# EAGLE design evalboard_v2_9 (EAGLE 9.6.2)
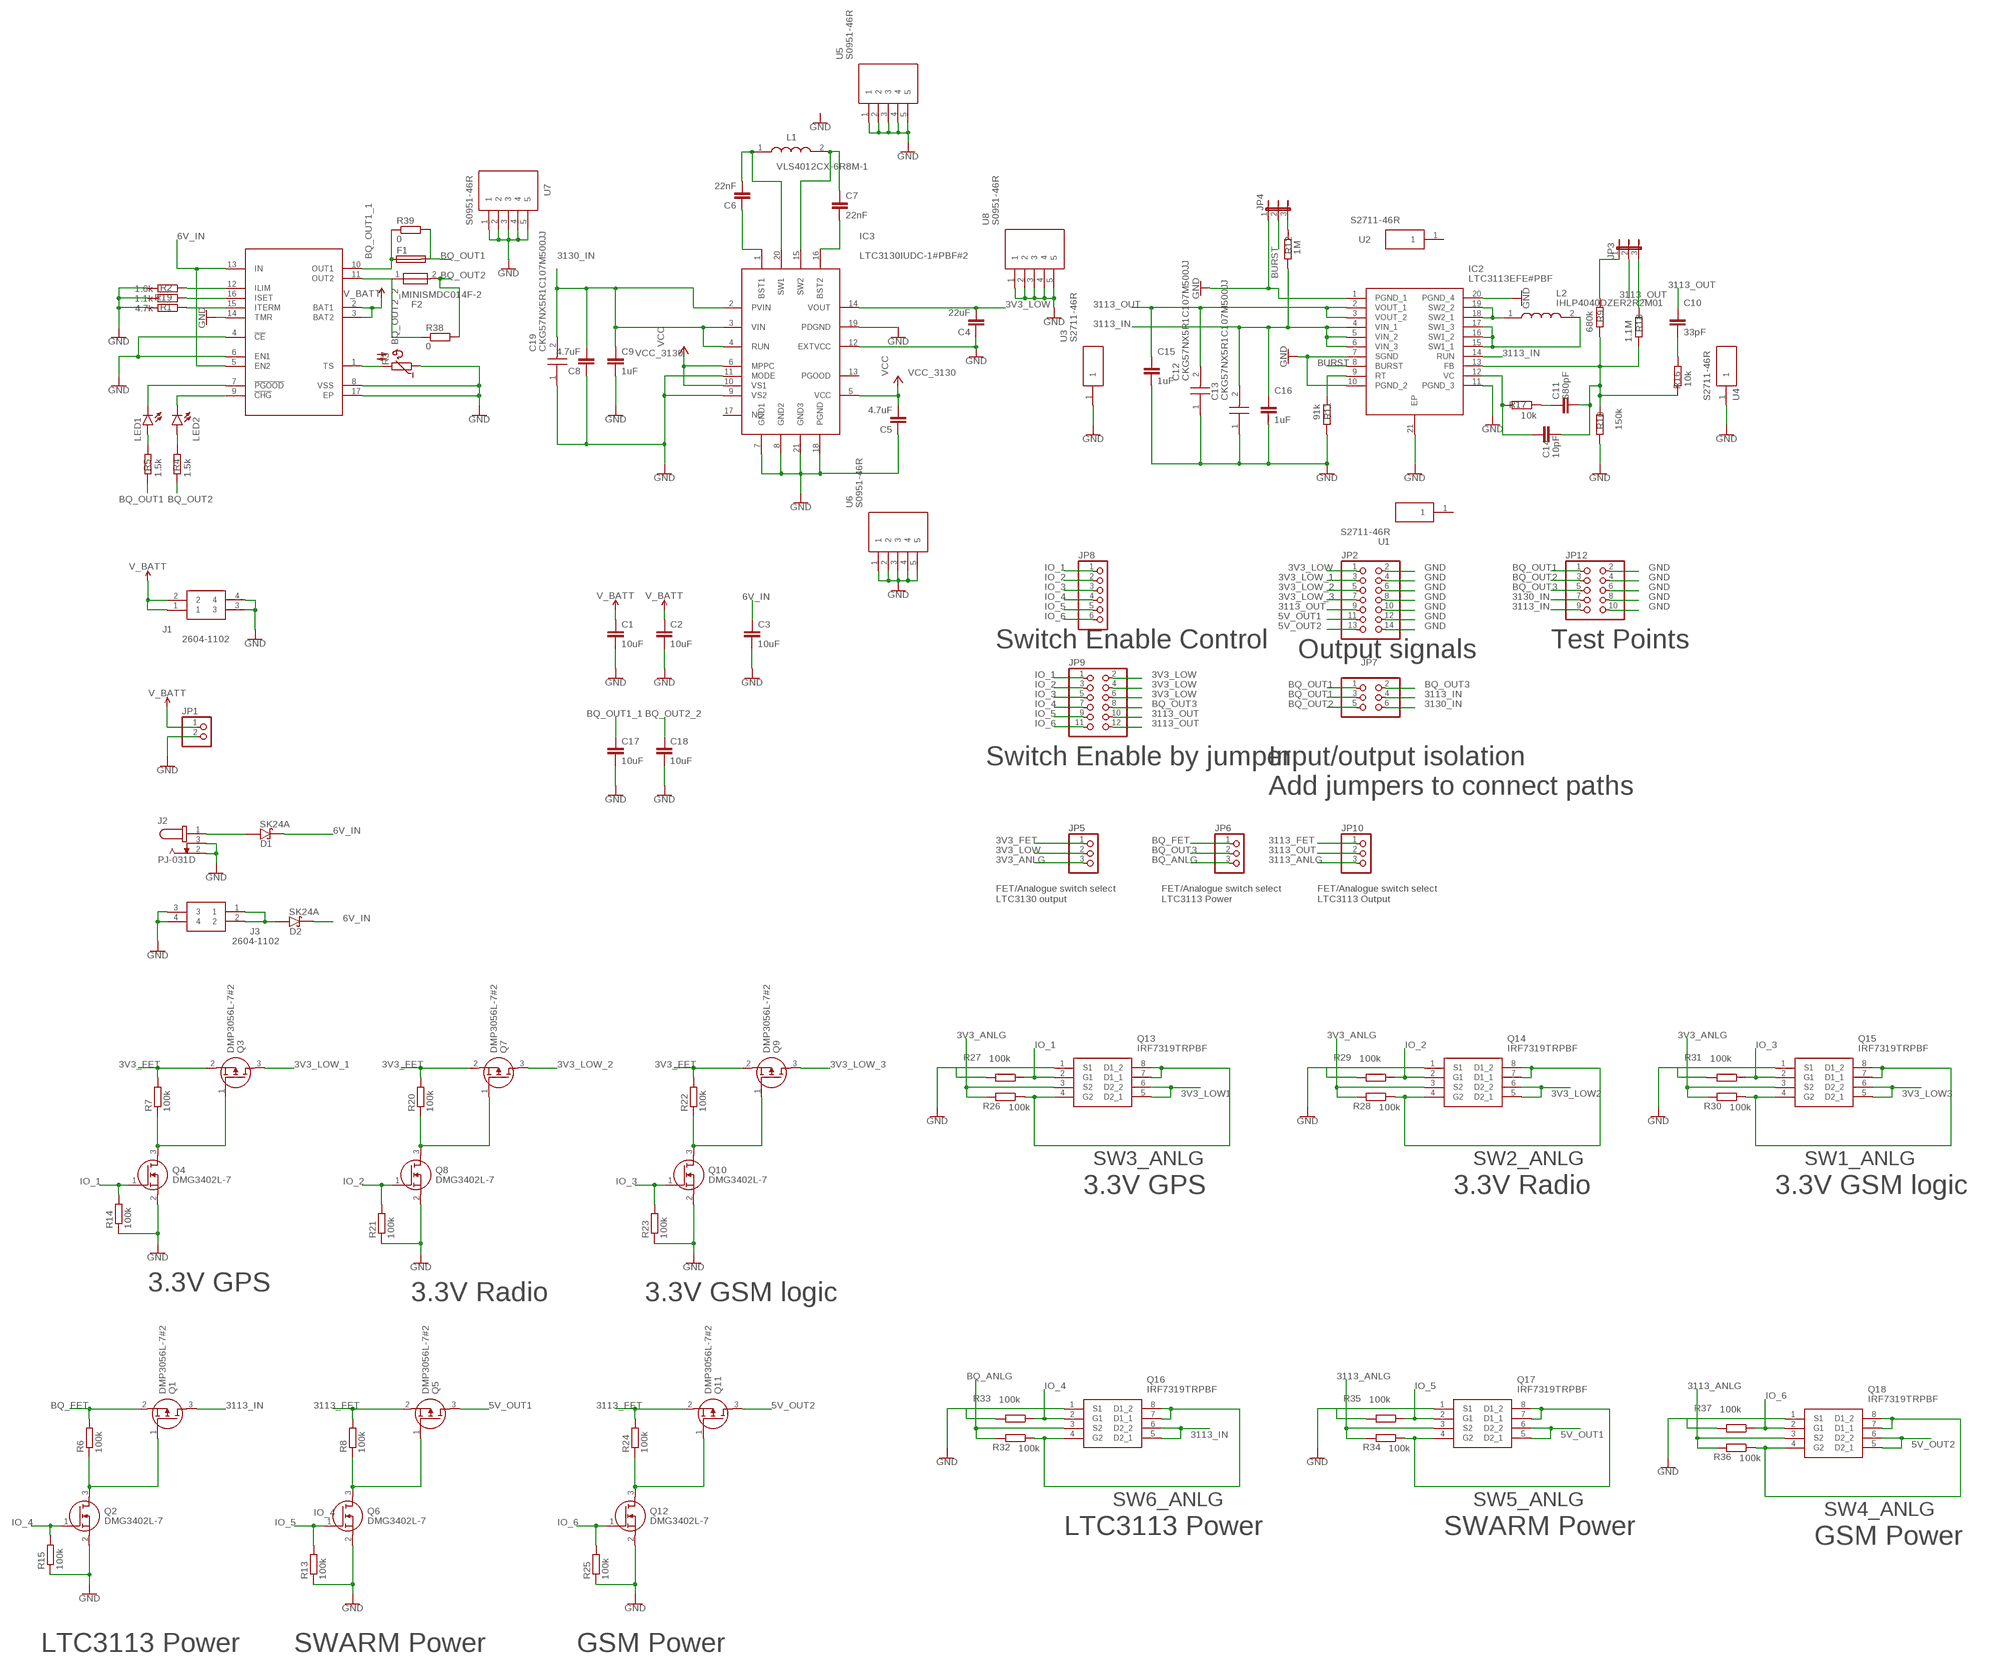
[diagram p0: schematic, sheet 1]

## Parts
C1  10uF  C-EUC1210  [C1210]
C2  10uF  C-EUC1210  [C1210]
C3  10uF  C-EUC1210  [C1210]
C4  22uF  C-EUC1210  [C1210]
C5  4.7uF  C-EUC1210  [C1210]
C6  22nF  C-EUC0603  [C0603]
C7  22nF  C-EUC0603  [C0603]
C8  4.7uF  C-EUC1210  [C1210]
C9  1uF  C-EUC0603  [C0603]
C10  33pF  C-EUC0603  [C0603]
C11  680pF  C-EUC0603  [C0603]
C12  CKG57NX5R1C107M500JJ  [CAPC6050X550N]
C13  CKG57NX5R1C107M500JJ  [CAPC6050X550N]
C14  10pF  C-EUC0603  [C0603]
C15  1uF  C-EUC0603  [C0603]
C16  1uF  C-EUC0603  [C0603]
C17  10uF  C-EUC1210  [C1210]
C18  10uF  C-EUC1210  [C1210]
C19  CKG57NX5R1C107M500JJ  [CAPC6050X550N]
D1  SK24A  [DIOM4325X250N]
D2  SK24A  [DIOM4325X250N]
F1  MF-USHT150KX-2SMD  [1210]
F2  MINISMDC014F-2  [FUSSC455X324X89-2N]
IC1  BQ24074  [QFN50P300X300X100-17N]
IC2  LTC3113EFE#PBF  [SOP65P640X120-21N]
IC3  LTC3130IUDC-1#PBF#2  [QFN50P300X400X80-21N]
J1  2604-1102  [26041102]
J2  PJ-031D  [CUI_PJ-031D]
J3  2604-1102  [26041102]
JP1  PINHD-1X2  [1X02]
JP2  PINHD-2X7  [2X07]
JP3  JP2E  [JP2]
JP4  JP2E  [JP2]
JP5  PINHD-1X3  [1X03]
JP6  PINHD-1X3  [1X03]
JP7  PINHD-2X3  [2X03]
JP8  PINHD-1X6  [1X06]
JP9  PINHD-2X6  [2X06]
JP10  PINHD-1X3  [1X03]
JP12  PINHD-2X5  [2X05]
L1  VLS4012CX-6R8M-1  [VLS4012]
L2  IHLP4040DZER2R2M01  [INDPM108102X400N]
LED1  LEDCHIP-LED0603  [CHIP-LED0603]
LED2  LEDCHIP-LED0603  [CHIP-LED0603]
Q1  DMP3056L-7#2  [SOT96P240X100-3N]
Q2  DMG3402L-7  [SOT96P240X110-3N]
Q3  DMP3056L-7#2  [SOT96P240X100-3N]
Q4  DMG3402L-7  [SOT96P240X110-3N]
Q5  DMP3056L-7#2  [SOT96P240X100-3N]
Q6  DMG3402L-7  [SOT96P240X110-3N]
Q7  DMP3056L-7#2  [SOT96P240X100-3N]
Q8  DMG3402L-7  [SOT96P240X110-3N]
Q9  DMP3056L-7#2  [SOT96P240X100-3N]
Q10  DMG3402L-7  [SOT96P240X110-3N]
Q11  DMP3056L-7#2  [SOT96P240X100-3N]
Q12  DMG3402L-7  [SOT96P240X110-3N]
Q13  IRF7319TRPBF  [SOIC127P600X175-8N]
Q14  IRF7319TRPBF  [SOIC127P600X175-8N]
Q15  IRF7319TRPBF  [SOIC127P600X175-8N]
Q16  IRF7319TRPBF  [SOIC127P600X175-8N]
Q17  IRF7319TRPBF  [SOIC127P600X175-8N]
Q18  IRF7319TRPBF  [SOIC127P600X175-8N]
R1  4.7k  R-EU_R0603  [R0603]
R2  1.6k  R-EU_R0603  [R0603]
R3  10k  NTC640  [P640]
R4  1.5k  R-EU_R0603  [R0603]
R5  1.5k  R-EU_R0603  [R0603]
R6  100k  R-EU_R0603  [R0603]
R7  100k  R-EU_R0603  [R0603]
R8  100k  R-EU_R0603  [R0603]
R9  680k  R-EU_R0603  [R0603]
R10  150k  R-EU_R0603  [R0603]
R11  91k  R-EU_R0603  [R0603]
R12  1M  R-EU_R0603  [R0603]
R13  100k  R-EU_R0603  [R0603]
R14  100k  R-EU_R0603  [R0603]
R15  100k  R-EU_R0603  [R0603]
R16  10k  R-EU_R0603  [R0603]
R17  10k  R-EU_R0603  [R0603]
R18  1.1M  R-EU_R0603  [R0603]
R19  1.1k  R-EU_R0603  [R0603]
R20  100k  R-EU_R0603  [R0603]
R21  100k  R-EU_R0603  [R0603]
R22  100k  R-EU_R0603  [R0603]
R23  100k  R-EU_R0603  [R0603]
R24  100k  R-EU_R0603  [R0603]
R25  100k  R-EU_R0603  [R0603]
R26  100k  R-EU_R0603  [R0603]
R27  100k  R-EU_R0603  [R0603]
R28  100k  R-EU_R0603  [R0603]
R29  100k  R-EU_R0603  [R0603]
R30  100k  R-EU_R0603  [R0603]
R31  100k  R-EU_R0603  [R0603]
R32  100k  R-EU_R0603  [R0603]
R33  100k  R-EU_R0603  [R0603]
R34  100k  R-EU_R0603  [R0603]
R35  100k  R-EU_R0603  [R0603]
R36  100k  R-EU_R0603  [R0603]
R37  100k  R-EU_R0603  [R0603]
R38  0  R-EU_R0603  [R0603]
R39  0  R-EU_R0603  [R0603]
U1  S2711-46R  [S271146R]
U2  S2711-46R  [S271146R]
U3  S2711-46R  [S271146R]
U4  S2711-46R  [S271146R]
U5  S0951-46R  [S095146R]
U6  S0951-46R  [S095146R]
U7  S0951-46R  [S095146R]
U8  S0951-46R  [S095146R]

## Nets
3V3_ANLG: JP5.3 Q13.3(S2) Q14.3(S2) Q15.3(S2) R26.2 R28.2 R30.2
3V3_FET: JP5.1 Q3.2(S) Q7.2(S) Q9.2(S) R7.2 R20.2 R22.2
3V3_LOW: C4.2 IC3.14(VOUT) JP2.1 JP5.2 JP9.2 JP9.4 JP9.6
3V3_LOW1: Q13.5(D2_1) Q13.6(D2_2)
3V3_LOW2: Q14.5(D2_1) Q14.6(D2_2)
3V3_LOW3: Q15.5(D2_1) Q15.6(D2_2)
3V3_LOW_1: JP2.3 Q3.3(D)
3V3_LOW_2: JP2.5 Q7.3(D)
3V3_LOW_3: JP2.7 Q9.3(D)
5V_OUT1: JP2.11 Q5.3(D) Q17.5(D2_1) Q17.6(D2_2)
5V_OUT2: JP2.13 Q11.3(D) Q18.5(D2_1) Q18.6(D2_2)
6V_IN: C3.1 D1.C(K) D2.C(K) IC1.5(EN2) IC1.13(IN)
3113_ANLG: JP10.3 Q17.3(S2) Q18.3(S2) R34.2 R36.2
3113_FET: JP10.1 Q5.2(S) Q11.2(S) R8.2 R24.2
3113_IN: C13.2 C16.1 IC2.4(VIN_1) IC2.5(VIN_2) IC2.6(VIN_3) IC2.14(RUN) JP7.4 JP12.9 Q1.3(D) Q16.5(D2_1) Q16.6(D2_2) R12.1
3113_OUT: C10.1 C12.2 C15.1 IC2.2(VOUT_1) IC2.3(VOUT_2) JP2.9 JP3.2 JP9.10 JP9.12 JP10.2
3130_IN: C8.2 C9.1 C19.2 IC3.2(PVIN) IC3.3(VIN) IC3.4(RUN) JP7.6 JP12.7
BQ_ANLG: JP6.3 Q16.3(S2) R32.2
BQ_FET: JP6.1 Q1.2(S) R6.2
BQ_OUT1: F1.2 JP7.1 JP7.3 JP12.1 R5.2 R39.2
BQ_OUT1_1: C17.1 F1.1 IC1.10(OUT1) R39.1
BQ_OUT2: F2.2 JP7.5 JP12.3 R4.2 R38.2
BQ_OUT2_2: C18.1 F2.1 IC1.11(OUT2) R38.1
BQ_OUT3: JP6.2 JP7.2 JP9.8 JP12.5
BURST: IC2.8(BURST) JP4.2
GND: C1.2 C2.2 C3.2 C4.1 C5.1 C8.1 C9.2 C12.1 C13.1 C15.2 C16.2 C17.2 C18.2 C19.1 IC1.4(!CE!) IC1.6(EN1) IC1.8(VSS) IC1.14(TMR) IC1.17(EP) IC2.1(PGND_1) IC2.7(SGND) IC2.10(PGND_2) IC2.11(PGND_3) IC2.20(PGND_4) IC2.21(EP) IC3.7(GND1) IC3.8(GND2) IC3.9(VS2) IC3.11(MODE) IC3.12(EXTVCC) IC3.18(PGND) IC3.19(PDGND) IC3.21(GND3) J1.3 J1.4 J2.2 J2.3 J3.3 J3.4 JP1.2 JP2.2 JP2.4 JP2.6 JP2.8 JP2.10 JP2.12 JP2.14 JP4.1 JP12.2 JP12.4 JP12.6 JP12.8 JP12.10 Q2.2(S) Q4.2(S) Q6.2(S) Q8.2(S) Q10.2(S) Q12.2(S) Q13.1(S1) Q14.1(S1) Q15.1(S1) Q16.1(S1) Q17.1(S1) Q18.1(S1) R1.2 R2.2 R3.1 R10.1 R11.1 R13.1 R14.1 R15.1 R19.2 R21.1 R23.1 R25.1 U3.1 U4.1 U5.1 U5.2 U5.3 U5.4 U5.5 U6.1 U6.2 U6.3 U6.4 U6.5 U7.1 U7.2 U7.3 U7.4 U7.5 U8.1 U8.2 U8.3 U8.4 U8.5
IO_1: JP8.1 JP9.1 Q4.1(G) Q13.2(G1) R14.2 R27.1 R27.2 R29.2 R31.2 R33.2 R35.2 R37.2
IO_2: JP8.2 JP9.3 Q8.1(G) Q14.2(G1) R21.2 R29.1
IO_3: JP8.3 JP9.5 Q10.1(G) Q15.2(G1) R23.2 R31.1
IO_4: JP8.4 JP9.7 Q2.1(G) Q16.2(G1) R15.2 R33.1
IO_5: JP8.5 JP9.9 Q6.1(G) Q17.2(G1) R13.2 R35.1
IO_6: JP8.6 JP9.11 Q12.1(G) Q18.2(G1) R25.2 R37.1
N$1: IC1.15(ITERM) R1.1
N$2: IC1.12(ILIM) R2.1
N$3: IC1.9(!CHG!) LED2.C
N$4: IC1.1(TS) R3.2
N$5: IC1.7(!PGOOD!) LED1.C
N$6: LED1.A R5.1
N$7: LED2.A R4.1
N$8: Q3.1(G) Q4.3(D) R7.1
N$9: D1.A J2.1
N$10: Q1.1(G) Q2.3(D) R6.1
N$11: Q5.1(G) Q6.3(D) R8.1
N$12: IC2.18(SW2_1) IC2.19(SW2_2) L2.1
N$13: IC2.15(SW1_1) IC2.16(SW1_2) IC2.17(SW1_3) L2.2
N$14: JP3.3 R18.2
N$15: C6.2 IC3.20(SW1) L1.1
N$16: C6.1 IC3.1(BST1)
N$17: C7.2 IC3.16(BST2)
N$18: IC2.9(RT) R11.2
N$19: C7.1 IC3.15(SW2) L1.2
N$20: JP4.3 R12.2
N$21: C11.1 R17.1
N$22: C10.2 R16.1
N$23: C11.2 C14.2 IC2.13(FB) R9.1 R10.2 R16.2 R18.1
N$24: C14.1 IC2.12(VC) R17.2
N$25: IC1.16(ISET) R19.1
N$26: JP3.1 R9.2
N$27: Q7.1(G) Q8.3(D) R20.1
N$28: Q9.1(G) Q10.3(D) R22.1
N$29: Q11.1(G) Q12.3(D) R24.1
N$30: Q14.4(G2) Q14.7(D1_1) Q14.8(D1_2) R28.1
N$31: Q15.4(G2) Q15.7(D1_1) Q15.8(D1_2) R30.1
N$32: Q16.4(G2) Q16.7(D1_1) Q16.8(D1_2) R32.1
N$33: Q17.4(G2) Q17.7(D1_1) Q17.8(D1_2) R34.1
N$34: Q13.4(G2) Q13.7(D1_1) Q13.8(D1_2) R26.1
N$35: Q18.4(G2) Q18.7(D1_1) Q18.8(D1_2) R36.1
N$37: D2.A J3.1 J3.2
V_BATT: C1.1 C2.1 IC1.2(BAT1) IC1.3(BAT2) J1.1 J1.2 JP1.1
VCC_3130: C5.2 IC3.5(VCC) IC3.6(MPPC) IC3.10(VS1) ; supply symbol labelled VCC
Unconnected: IC3.13(PGOOD) IC3.17(NC) U1.1 U2.1

## Notes on the sheet
- Switch Enable Control | Test Points
- Output signals
- Switch Enable by jumper
- Input/output isolation
  Add jumpers to connect paths
- FET/Analogue switch select
  LTC3130 output
- FET/Analogue switch select
  LTC3113 Power
- FET/Analogue switch select
  LTC3113 Output
- SW3_ANLG | SW2_ANLG | SW1_ANLG
- 3.3V GPS | 3.3V Radio | 3.3V GSM logic
- 3.3V GPS
- 3.3V Radio | 3.3V GSM logic
- SW6_ANLG | SW5_ANLG
- SW4_ANLG
- LTC3113 Power | SWARM Power
- GSM Power
- LTC3113 Power | SWARM Power | GSM Power

## Library data of the parts
C1-C11 C14-C18 = rcl:C-EU: CAPACITOR, European symbol; SPICEPREFIX: C
C12 C13 C19 = SamacSys_Parts:CKG57NX5R1C107M500JJ: Multilayer Ceramic Capacitors MLCC - SMD/SMT CKG 2220 16V 100uF 20% T:5mm AEC-Q200 Source: Datasheet <https://product.tdk.com/system/files/dam/doc/product/capacitor/ceramic/mlcc/catalog/mlcc_automotive_megacap_en.pdf>; DESCRIPTION: Multilayer Ceramic Capacitors MLCC - SMD/SMT CKG 2220 16V 100uF 20% T:5mm AEC-Q200; HEIGHT: 5.5mm; MANUFACTURER_NAME: TDK; MANUFACTURER_PART_NUMBER: CKG57NX5R1C107M500JJ; MOUSER_PART_NUMBER: 810-CKG57NX5R1C107MJ; MOUSER_PRICE-STOCK: https://www.mouser.co.uk/ProductDetail/TDK/CKG57NX5R1C107M500JJ?qs=xLDY6iXSiQbsKuTXjNfGvw%3D%3D
D1 D2 = SK24A:SK24A; DESCRIPTION: Diode Schottky 40 V - Surface Mount SMA (DO-214AC); DIGI-KEY_PART_NUMBER: 1655-SK24ATR-ND; MF: SMC Diode; MP: SK24A; PACKAGE: SMA Taiwan Semiconductor; PURCHASE-URL: https://pricing.snapeda.com/search/part/SK24A/?ref=eda
F1 = my_library:MF-USHT150KX-2
F2 = MINISMDC014F-2:MINISMDC014F-2: PTC RESET FUSE 60V 140MA 1812 Check availability <https://pricing.snapeda.com/parts/MINISMDC014F-2/Littelfuse%20Inc./view-part?ref=eda>; AVAILABILITY: In Stock; DESCRIPTION: Polymeric PTC Resettable Fuse 60V 140 mA Ih Surface Mount 1812 (4532 Metric), Concave; MF: Littelfuse Inc.; MP: MINISMDC014F-2; PACKAGE: None; PRICE: None; PURCHASE-URL: https://pricing.snapeda.com/search/part/MINISMDC014F-2/?ref=eda
IC1 = SamacSys_Parts:BQ24074
IC2 = SamacSys_Parts:LTC3113EFE#PBF: Buck-Boost Switching Regulator IC Positive Adjustable 1.8V 1 Output 3A 20-TSSOP (0.173", 4.40mm Width) Exposed Pad Source: Datasheet <http://www.linear.com/docs/30065>; DESCRIPTION: Buck-Boost Switching Regulator IC Positive Adjustable 1.8V 1 Output 3A 20-TSSOP (0.173", 4.40mm Width) Exposed Pad; HEIGHT: 1.2mm; MANUFACTURER_NAME: Analog Devices; MANUFACTURER_PART_NUMBER: LTC3113EFE#PBF; MOUSER_PART_NUMBER: 584-LTC3113EFE#PBF; MOUSER_PRICE-STOCK: https://www.mouser.co.uk/ProductDetail/Analog-Devices-Linear-Technology/LTC3113EFEPBF?qs=hVkxg5c3xu9hNe5Vps7nKA%3D%3D
IC3 = SamacSys_Parts:LTC3130IUDC-1#PBF#2: LINEAR TECHNOLOGY - LTC3130IUDC-1#PBF - DC/DC Switching Buck-Boost Regulator, Adjustable, 2.4V-25V in, 1.8V-12V out, 600 mA, QFN-20 Source: Datasheet <https://ms.componentsearchengine.com/Datasheets/2/LTC3130IUDC-1#PBF.pdf>; DESCRIPTION: LINEAR TECHNOLOGY - LTC3130IUDC-1#PBF - DC/DC Switching Buck-Boost Regulator, Adjustable, 2.4V-25V in, 1.8V-12V out, 600 mA, QFN-20; HEIGHT: 0.8mm; MANUFACTURER_NAME: Analog Devices; MANUFACTURER_PART_NUMBER: LTC3130IUDC-1#PBF
J1 J3 = SamacSys_Parts:2604-1102: WAGO - 2604-1102 - TB, WIRE TO BOARD, 2POS, 24-12AWG Source: Datasheet <https://www.wago.com/de/leiterplattenanschluss/leiterplattenklemme/p/2604-1102>; ARROW_PART_NUMBER: 2604-1102; ARROW_PRICE-STOCK: https://www.arrow.com/en/products/2604-1102/wago-kontakttechnik-gmbh?region=nac; DESCRIPTION: WAGO - 2604-1102 - TB, WIRE TO BOARD, 2POS, 24-12AWG; HEIGHT: 16.7mm; MANUFACTURER_NAME: Wago; MANUFACTURER_PART_NUMBER: 2604-1102
J2 = PJ-031D:PJ-031D: 1.3 mm Center Pin, 2.0 A, Right Angle, Through Hole, Dc Power Jack Connector Check availability <https://pricing.snapeda.com/parts/PJ-031D/CUI%20Devices/view-part?ref=eda>; AVAILABILITY: In Stock; CUI_PURCHASE_URL: https://www.cuidevices.com/product/interconnect/connectors/dc-power-connectors/jacks/pj-031d?utm_source=snapeda.com&utm_medium=referral&utm_campaign=snapedaBOM; DESCRIPTION: 1.3 x 4.2 mm, 2.0 A, Horizontal, Through Hole, Dc Power Jack Connector; MF: CUI Devices; MP: PJ-031D; PACKAGE: None; PRICE: None; PURCHASE-URL: https://pricing.snapeda.com/search/part/PJ-031D/?ref=eda
JP1 = pinhead:PINHD-1X2: PIN HEADER
JP2 = pinhead:PINHD-2X7: PIN HEADER
JP3 JP4 = jumper:JP2E: JUMPER
JP5 JP6 JP10 = pinhead:PINHD-1X3: PIN HEADER
JP7 = pinhead:PINHD-2X3: PIN HEADER
JP8 = pinhead:PINHD-1X6: PIN HEADER
JP9 = pinhead:PINHD-2X6: PIN HEADER
JP12 = pinhead:PINHD-2X5: PIN HEADER
L1 = SamacSys_Parts:VLS4012CX-6R8M-1: SMD / SMT Inductors (Coils), L=6.8?H, L x W x T : Source: Datasheet <https://product.tdk.com/system/files/dam/doc/product/inductor/inductor/smd/catalog/inductor_commercial_power_vls4012cx-1_en.pdf>; DESCRIPTION: SMD / SMT Inductors (Coils), L=6.8?H, L x W x T :; HEIGHT: mm; MANUFACTURER_NAME: TDK; MANUFACTURER_PART_NUMBER: VLS4012CX-6R8M-1
L2 = SamacSys_Parts:IHLP4040DZER2R2M01: Vishay IHLP4040DZ-01 Series Shielded Wire-wound SMD Inductor 2.2 uH +/-20% 25.6A Idc Source: Datasheet <https://www.vishay.com/docs/34193/ihlp-4040dz-01.pdf>; ARROW_PART_NUMBER: IHLP4040DZER2R2M01; ARROW_PRICE-STOCK: https://www.arrow.com/en/products/ihlp4040dzer2r2m01/vishay?region=europe; DESCRIPTION: Vishay IHLP4040DZ-01 Series Shielded Wire-wound SMD Inductor 2.2 uH +/-20% 25.6A Idc; HEIGHT: 4mm; MANUFACTURER_NAME: Vishay; MANUFACTURER_PART_NUMBER: IHLP4040DZER2R2M01; MOUSER_PART_NUMBER: 70-IHLP4040DZER2R2M0; MOUSER_PRICE-STOCK: https://www.mouser.co.uk/ProductDetail/Vishay-Dale/IHLP4040DZER2R2M01?qs=25W9pqL97j%252B8m%252BOw36nwKg%3D%3D
LED1 LED2 = led:LED: LED OSRAM: - CHIPLED LG R971, LG N971, LY N971, LG Q971, LY Q971, LO R971, LY R971 LH N974, LH R974 LS Q976, LO Q976, LY Q976 LO Q996 - Hyper CHIPLED LW Q18S LB Q993, LB Q99A, LB R99A - SideLED LS A670, LO A670, LY A670, LG A670, LP A670 LB A673, LV A673, LT A673, LW A673 LH A674 LY A675 LS A676, LA A676, LO A676, LY A676, LW A676 LS A679, LY A679, LG A679 - Hyper Micro SIDELED® LS Y876, LA Y876, LO Y876, LY Y876 LT Y87S - SmartLED LW L88C, LW L88S LB L89C, LB L89S, LG L890 LS L89K, LO L89K, LY L89K LS L896, LA L896, LO L896, LY L896 - TOPLED LS T670, LO T670, LY T670, LG T670, LP T670 LSG T670, LSP T670, LSY T670, LOP T670, LYG T670 LG T671, LOG T671, LSG T671 LB T673, LV T673, LT T673, LW T673 LH T674 LS T676, LA T676, LO T676, LY T676, LB T676, LH T676, LSB T676, LW T676 LB T67C, LV T67C, LT T67C, LS T67K, LO T67K, LY T67K, LW E67C LS E67B, LA E67B, LO E67B, LY E67B, LB E67C, LV E67C, LT E67C LW T67C LS T679, LY T679, LG T679 LS T770, LO T770, LY T770, LG T770, LP T770 LB T773, LV T773, LT T773, LW T773 LH T774 LS E675, LA E675, LY E675, LS T675 LS T776, LA T776, LO T776, LY T776, LB T776 LHGB T686 LT T68C, LB T68C - Hyper Mini TOPLED® LB M676 - Mini TOPLED Santana® LG M470 LS M47K, LO M47K, LY M47K Source: http://www.osram.convergy.de LUXEON: - LUMILED® LXK2-PW12-R00, LXK2-PW12-S00, LXK2-PW14-U00, LXK2-PW14-V00 LXK2-PM12-R00, LXK2-PM12-S00, LXK2-PM14-U00 LXK2-PE12-Q00, LXK2-PE12-R00, LXK2-PE12-S00, LXK2-PE14-T00, LXK2-PE14-U00 LXK2-PB12-K00, LXK2-PB12-L00, LXK2-PB12-M00, LXK2-PB14-N00, LXK2-PB14-P00, LXK2-PB14-Q00 LXK2-PR12-L00, LXK2-PR12-M00, LXK2-PR14-Q00, LXK2-PR14-R00 LXK2-PD12-Q00, LXK2-PD12-R00, LXK2-PD12-S00 LXK2-PH12-R00, LXK2-PH12-S00 LXK2-PL12-P00, LXK2-PL12-Q00, LXK2-PL12-R00 Source: www.luxeon.com KINGBRIGHT: KA-3528ASYC Source: www.kingbright.com
Q1 Q3 Q5 Q7 Q9 Q11 = SamacSys_Parts:DMP3056L-7#2: MOSFET 30V P-Ch Enh Mode 50mOhm -10Vgs -4.3A Source: Datasheet <https://www.diodes.com/assets/Datasheets/DMP3056L.pdf>; ARROW_PART_NUMBER: DMP3056L-7; ARROW_PRICE-STOCK: https://www.arrow.com/en/products/dmp3056l-7/diodes-incorporated?region=nac; DESCRIPTION: MOSFET 30V P-Ch Enh Mode 50mOhm -10Vgs -4.3A; HEIGHT: 1mm; MANUFACTURER_NAME: Diodes Inc.; MANUFACTURER_PART_NUMBER: DMP3056L-7; MOUSER_PART_NUMBER: 621-DMP3056L-7; MOUSER_PRICE-STOCK: https://www.mouser.co.uk/ProductDetail/Diodes-Incorporated/DMP3056L-7?qs=OVC8WVYZliQTX9kMWW%252B96Q%3D%3D
Q2 Q4 Q6 Q8 Q10 Q12 = SamacSys_Parts:DMG3402L-7: Diodes Inc DMG3402L-7 N-channel MOSFET Transistor, 4 A, 30 V, 3-Pin SOT-23 Source: Datasheet <https://www.diodes.com/assets/Datasheets/DMG3402L.pdf>; ARROW_PART_NUMBER: DMG3402L-7; ARROW_PRICE-STOCK: https://www.arrow.com/en/products/dmg3402l-7/diodes-incorporated?region=nac; DESCRIPTION: Diodes Inc DMG3402L-7 N-channel MOSFET Transistor, 4 A, 30 V, 3-Pin SOT-23; HEIGHT: 1.1mm; MANUFACTURER_NAME: Diodes Inc.; MANUFACTURER_PART_NUMBER: DMG3402L-7; MOUSER_PART_NUMBER: 621-DMG3402L-7; MOUSER_PRICE-STOCK: https://www.mouser.co.uk/ProductDetail/Diodes-Incorporated/DMG3402L-7?qs=M%2FOdCRO8QQ3OmR%252BxqWZuSw%3D%3D
Q13-Q18 = SamacSys_Parts:IRF7319TRPBF: IRF7319TRPBF Dual N/P-Channel MOSFET, 4.9 A, 6.5 A, 30 V HEXFET, 8-Pin SOIC Infineon Source: Datasheet <https://www.infineon.com/dgdl/irf7319pbf.pdf?fileId=5546d462533600a4015355f5c82f1b41>; ARROW_PART_NUMBER: IRF7319TRPBF; ARROW_PRICE-STOCK: https://www.arrow.com/en/products/irf7319trpbf/infineon-technologies-ag?region=nac; DESCRIPTION: IRF7319TRPBF Dual N/P-Channel MOSFET, 4.9 A, 6.5 A, 30 V HEXFET, 8-Pin SOIC Infineon; HEIGHT: 1.75mm; MANUFACTURER_NAME: Infineon; MANUFACTURER_PART_NUMBER: IRF7319TRPBF; MOUSER_PART_NUMBER: 942-IRF7319TRPBF; MOUSER_PRICE-STOCK: https://www.mouser.co.uk/ProductDetail/Infineon-IR/IRF7319TRPBF?qs=9%252BKlkBgLFf3yLUxG6ZIMRA%3D%3D
R1 R2 R4-R39 = rcl:R-EU_: RESISTOR, European symbol; SPICEPREFIX: R
R3 = ptc-ntc:NTC640: PHILIPS NTC; OC_FARNELL: unknown; OC_NEWARK: unknown
U1-U4 = SamacSys_Parts:S2711-46R: EMI Gaskets, Sheets, Absorbers & Shielding EMC Shield Can Clip .17-.3MM Thick Cans Source: Datasheet <https://cdn.harwin.com/pdfs/S2711-46R.pdf>; DESCRIPTION: EMI Gaskets, Sheets, Absorbers & Shielding EMC Shield Can Clip .17-.3MM Thick Cans; HEIGHT: 3.75mm; MANUFACTURER_NAME: Harwin; MANUFACTURER_PART_NUMBER: S2711-46R
U5-U8 = SamacSys_Parts:S0951-46R: EMI Gaskets, Sheets, Absorbers & Shielding EMC Shield Can Clip 0.20MM Thick Cans Source: Datasheet <https://componentsearchengine.com/Datasheets/2/S0951-46R.pdf>; DESCRIPTION: EMI Gaskets, Sheets, Absorbers & Shielding EMC Shield Can Clip 0.20MM Thick Cans; HEIGHT: 1.28mm; MANUFACTURER_NAME: Harwin; MANUFACTURER_PART_NUMBER: S0951-46R; MOUSER_PART_NUMBER: 855-S0951-46R; MOUSER_PRICE-STOCK: https://www.mouser.co.uk/ProductDetail/Harwin/S0951-46R?qs=je9i9FKnZoxYFq7KaU8dxA%3D%3D

## Board
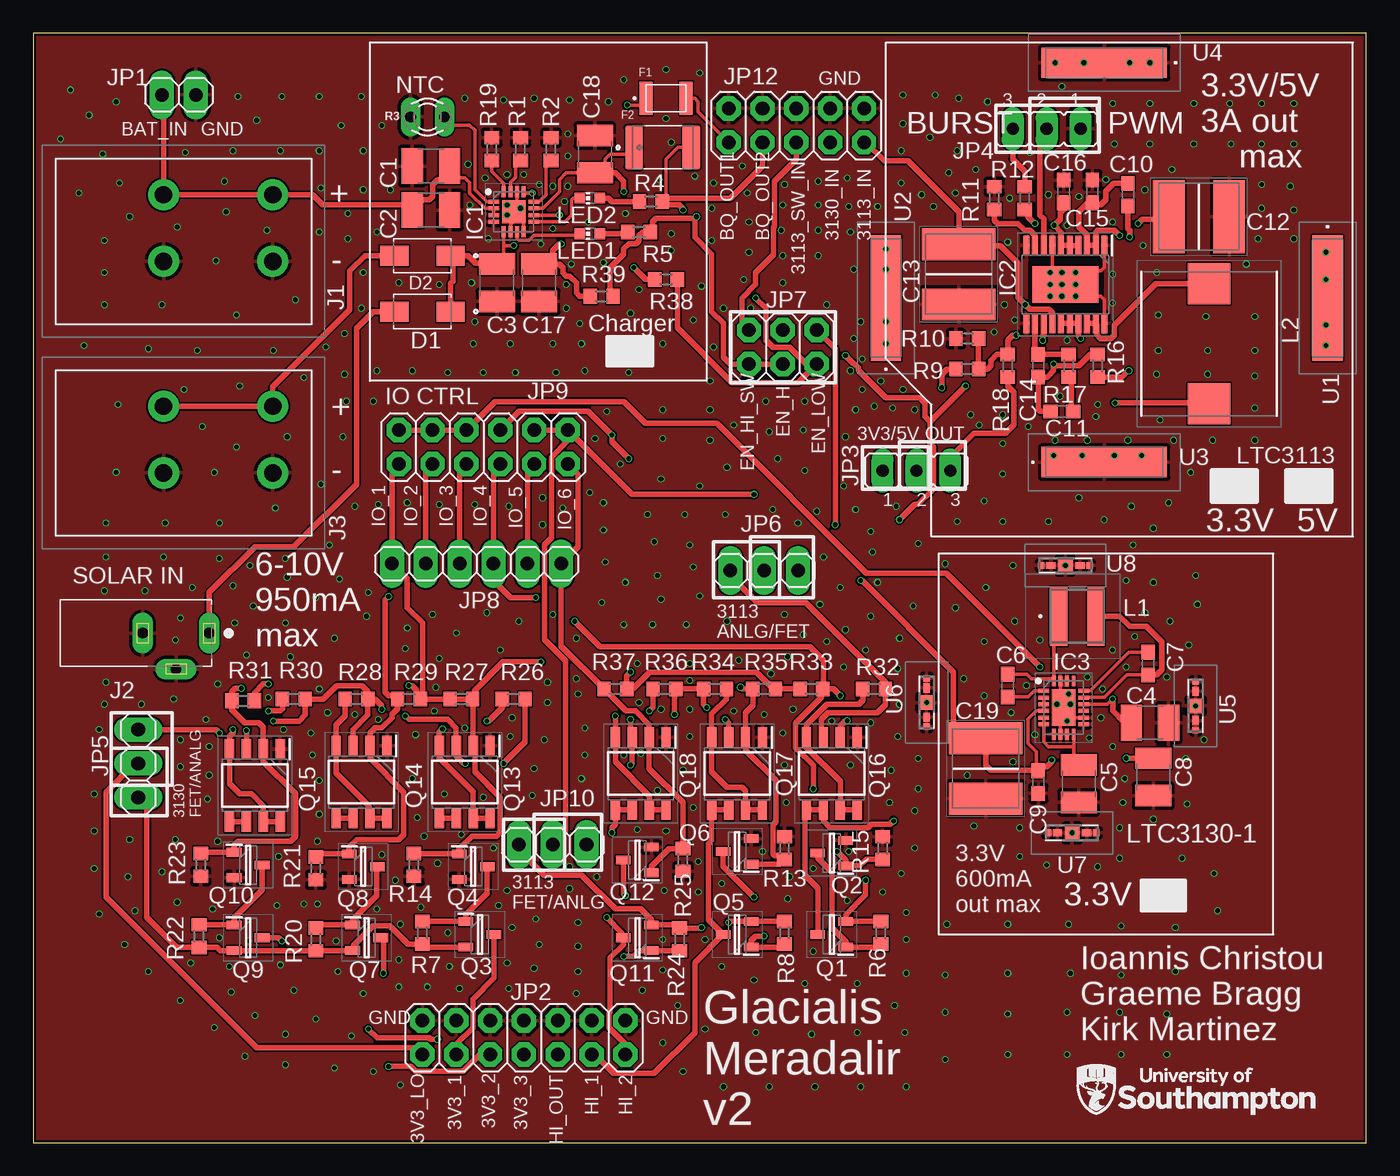
[diagram p1: board, top side]
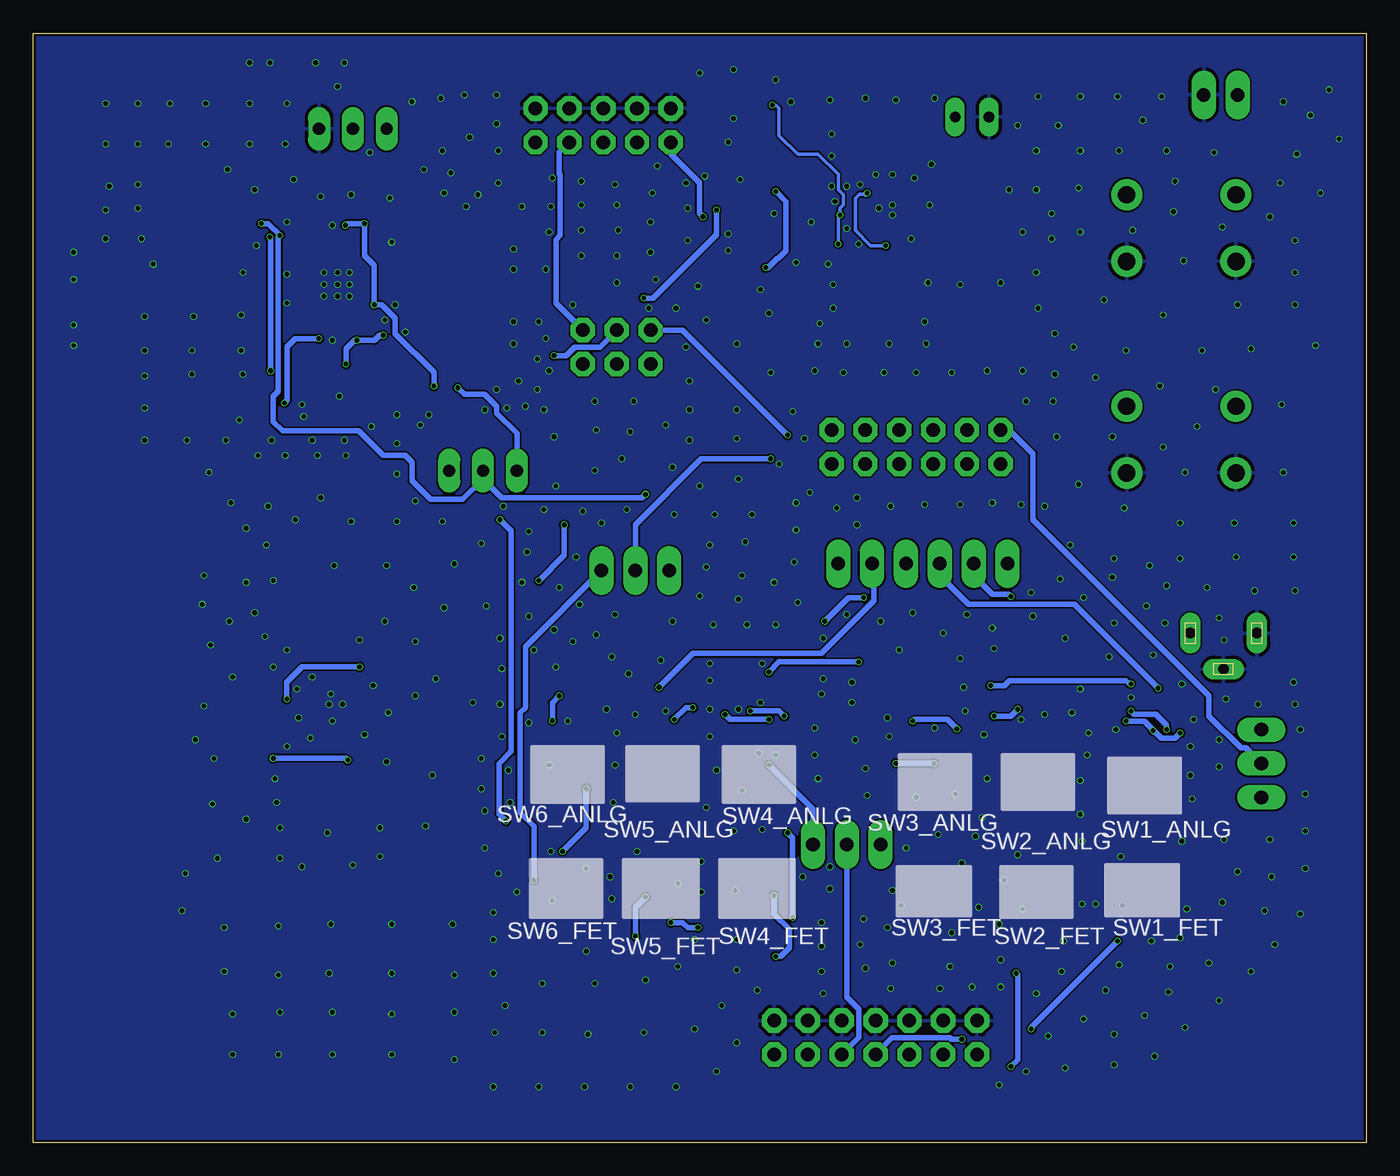
[diagram p2: board, bottom side, seen from below]

Size 100.06 x 83.24 mm. Coordinates in mm from the lower left corner, seen from the top.
Outline: 0,0 100.06,0 100.06,83.24 0,83.24 0,0
Copper layers (1*16): Top 0.035mm / dielectric 1.6mm / Bottom 0.035mm
Design rules "jlcpcb-2layers": minimum track width 5mil, minimum drill 0.3mm, track to track 5mil, track to pad 5mil, pad to pad 5mil, via to via 5mil, smd to smd 5mil, copper to edge 0.2mm, drill to drill 6mil, minimum pad ring 10mil, minimum via ring 3mil, stop-mask expansion 4mil, vias tented up to drill 0mil, thermal gap 10mil
tRestrict: area 35.1,68.8 to 37.1,70.9; area 76.3,31.1 to 78.4,34; area 74.8,62.9 to 80.3,66; area 74.8,62 to 80.1,62.9

### Footprints (pad centres in the part's own frame; a part is rotated, then mirrored left to right if it is on the bottom)
C1210 = smd 1.6 x 2.7: 1 -1.4,0; 2 1.4,0
C0603 = smd 1.1 x 1: 1 -0.85,0; 2 0.85,0
CAPC6050X550N = smd 2.39 x 5.51: 1 -2.26,0; 2 2.26,0
DIOM4325X250N = smd 2.12 x 1.5: A 2.115,0; C -2.115,0
1210 = smd 1 x 2.5: 1 -1.5,0; 2 1.5,0
FUSSC455X324X89-2N = smd 1.34 x 3.29: 1 -2.15,0; 2 2.15,0
QFN50P300X300X100-17N = smd 0.8 x 0.3: 1 -1.5,0.75; 2 -1.5,0.25; 3 -1.5,-0.25; 4 -1.5,-0.75; 9 1.5,-0.75; 10 1.5,-0.25; 11 1.5,0.25; 12 1.5,0.75 | smd 0.3 x 0.8: 5 -0.75,-1.5; 6 -0.25,-1.5; 7 0.25,-1.5; 8 0.75,-1.5; 13 0.75,1.5; 14 0.25,1.5; 15 -0.25,1.5; 16 -0.75,1.5 | smd 1.75 x 1.75: 17 0,0
SOP65P640X120-21N = smd 1.45 x 0.45: 1 -2.925,2.925; 2 -2.925,2.275; 3 -2.925,1.625; 4 -2.925,0.975; 5 -2.925,0.325; 6 -2.925,-0.325; 7 -2.925,-0.975; 8 -2.925,-1.625; 9 -2.925,-2.275; 10 -2.925,-2.925; 11 2.925,-2.925; 12 2.925,-2.275; 13 2.925,-1.625; 14 2.925,-0.975; 15 2.925,-0.325; 16 2.925,0.325; 17 2.925,0.975; 18 2.925,1.625; 19 2.925,2.275; 20 2.925,2.925 | smd 2.74 x 4.95: 21 0,0
QFN50P300X400X80-21N = smd 0.8 x 0.3: 1 -1.5,1.25; 2 -1.5,0.75; 3 -1.5,0.25; 4 -1.5,-0.25; 5 -1.5,-0.75; 6 -1.5,-1.25; 11 1.5,-1.25; 12 1.5,-0.75; 13 1.5,-0.25; 14 1.5,0.25; 15 1.5,0.75; 16 1.5,1.25 | smd 0.3 x 0.8: 7 -0.75,-2; 8 -0.25,-2; 9 0.25,-2; 10 0.75,-2; 17 0.75,2; 18 0.25,2; 19 -0.25,2; 20 -0.75,2 | smd 1.75 x 2.75: 21 0,0
26041102 = drill 1.3 pad 1.95: 1 0,0; 2 0,8.2; 3 5,0; 4 5,8.2
CUI_PJ-031D = drill 0.8 pad 1.524 long: 1 0,0; 2 5,0; 3 2.5,2.7
1X02 = drill 1.016 long: 1 -1.27,0; 2 1.27,0
2X07 = drill 1.016 octagon: 1 -7.62,-1.27; 2 -7.62,1.27; 3 -5.08,-1.27; 4 -5.08,1.27; 5 -2.54,-1.27; 6 -2.54,1.27; 7 0,-1.27; 8 0,1.27; 9 2.54,-1.27; 10 2.54,1.27; 11 5.08,-1.27; 12 5.08,1.27; 13 7.62,-1.27; 14 7.62,1.27
JP2 = drill 0.914 long: 1 -2.54,0; 2 0,0; 3 2.54,0
1X03 = drill 1.016 long: 1 -2.54,0; 2 0,0; 3 2.54,0
2X03 = drill 1.016 octagon: 1 -2.54,-1.27; 2 -2.54,1.27; 3 0,-1.27; 4 0,1.27; 5 2.54,-1.27; 6 2.54,1.27
1X06 = drill 1.016 long: 1 -6.35,0; 2 -3.81,0; 3 -1.27,0; 4 1.27,0; 5 3.81,0; 6 6.35,0
2X06 = drill 1.016 octagon: 1 -6.35,-1.27; 2 -6.35,1.27; 3 -3.81,-1.27; 4 -3.81,1.27; 5 -1.27,-1.27; 6 -1.27,1.27; 7 1.27,-1.27; 8 1.27,1.27; 9 3.81,-1.27; 10 3.81,1.27; 11 6.35,-1.27; 12 6.35,1.27
2X05 = drill 1.016 octagon: 1 -5.08,-1.27; 2 -5.08,1.27; 3 -2.54,-1.27; 4 -2.54,1.27; 5 0,-1.27; 6 0,1.27; 7 2.54,-1.27; 8 2.54,1.27; 9 5.08,-1.27; 10 5.08,1.27
VLS4012 = smd 1.3 x 4.4: 1 -1.4,0; 2 1.4,0
INDPM108102X400N = smd 3.05 x 3.2: 1 -4.5,0; 2 4.5,0
CHIP-LED0603 = smd 0.8 x 0.8: A 0,-0.75; C 0,0.75
SOT96P240X100-3N = smd 1.1 x 0.65: 1 -1.05,0.96; 2 -1.05,-0.96; 3 1.05,0
SOT96P240X110-3N = smd 1.1 x 0.65: 1 -1.05,0.96; 2 -1.05,-0.96; 3 1.05,0
SOIC127P600X175-8N = smd 1.525 x 0.7: 1 -2.712,1.905; 2 -2.712,0.635; 3 -2.712,-0.635; 4 -2.712,-1.905; 5 2.712,-1.905; 6 2.712,-0.635; 7 2.712,0.635; 8 2.712,1.905
R0603 = smd 1 x 1.1: 1 -0.85,0; 2 0.85,0
P640 = drill 0.813 long: 1 -1.27,0; 2 1.27,0
S271146R = smd 9.4 x 2.28: 1 0,0
S095146R = smd 0.48 x 0.5: 1 -1.81,0; 5 1.81,0 | smd 0.7 x 0.5: 2 -1.1,0; 4 1.1,0 | smd 1.1 x 1.2: 3 0,0

### Placement (x,y rotation side)
C1  29.84,73.28 180 top
C2  29.84,69.98 0 top
C3  34.8,64.52 270 top
C4  83.82,31.5 180 top
C5  78.49,26.92 90 top
C6  73.15,34.29 90 top
C7  83.69,35.94 90 top
C8  84.07,27.43 90 top
C9  75.44,27.05 270 top
C10  82.17,71.12 270 top
C11  77.22,54.86 180 top
C12  87.5,69.47 180 top
C13  69.47,65.15 90 top
C14  75.44,58.29 270 top
C15  79.5,71.37 90 top
C16  77.34,71.37 90 top
C17  37.97,64.52 270 top
C18  42.16,74.17 90 top
C19  71.5,28.07 90 top
D1  29.21,62.36 180 top
D2  29.21,66.55 180 top
F1  47.5,78.36 0 top
F2  47.24,74.68 0 top
IC1  36.07,69.85 0 top
IC2  77.47,64.39 270 top
IC3  77.34,32.64 0 top
J1  9.78,71.12 270 top
J2  13.21,38.23 180 top
J3  9.78,55.24 270 top
JP1  10.92,78.61 0 top
JP2  36.83,7.87 0 top
JP3  66.29,50.42 0 top
JP4  76.07,76.07 180 top
JP5  7.87,28.45 90 top
JP6  54.86,42.93 180 top
JP7  56.26,59.69 0 top
JP8  33.27,43.43 0 top
JP9  33.78,52.2 0 top
JP10  38.99,22.35 0 top
JP12  57.28,76.33 0 top
L1  78.36,39.5 0 top
L2  88.27,59.94 270 top
LED1  41.78,68.2 90 top
LED2  41.78,70.87 90 top
Q1  59.94,15.62 180 top
Q2  59.94,21.72 180 top
Q3  33.53,15.62 0 top
Q4  33.02,20.7 0 top
Q5  52.83,15.62 180 top
Q6  52.83,21.84 180 top
Q7  25.02,15.37 0 top
Q8  24.77,20.7 0 top
Q9  16.13,15.37 0 top
Q10  16.13,20.83 0 top
Q11  45.34,15.37 180 top
Q12  45.34,21.21 180 top
Q13  32.38,27.05 270 top
Q14  24.64,27.05 270 top
Q15  16.64,26.8 270 top
Q16  59.94,27.69 270 top
Q17  52.83,27.69 270 top
Q18  45.59,27.69 270 top
R1  36.58,74.55 90 top
R2  38.86,74.55 90 top
R3  29.59,76.96 0 top
R4  46.35,70.61 0 top
R5  45.47,68.33 0 top
R6  63.63,15.75 90 top
R7  29.21,15.75 270 top
R8  56.39,15.75 90 top
R9  70.1,58.04 180 top
R10  70.1,60.33 0 top
R11  72.14,70.87 270 top
R12  74.42,70.87 90 top
R13  56.39,22.1 270 top
R14  28.57,20.83 90 top
R15  63.75,22.1 270 top
R16  79.88,58.29 90 top
R17  77.72,58.29 90 top
R18  73.15,58.29 270 top
R19  34.42,74.55 90 top
R20  21.21,15.24 270 top
R21  21.21,20.57 90 top
R22  12.45,15.49 270 top
R23  12.57,20.83 90 top
R24  48.51,15.24 90 top
R25  48.77,21.21 90 top
R26  36.07,33.27 0 top
R27  32.13,33.27 0 top
R28  24.26,33.27 0 top
R29  28.19,33.27 0 top
R30  19.56,33.27 0 top
R31  15.75,33.15 0 top
R32  63.12,34.04 0 top
R33  58.42,34.04 180 top
R34  51.18,34.04 180 top
R35  54.86,34.04 0 top
R36  47.37,34.04 0 top
R37  43.69,34.04 0 top
R38  47.5,64.77 0 top
R39  42.67,63.5 0 top
U1  97.16,63.37 270 top
U2  64.01,63.37 90 top
U3  80.39,51.05 0 top
U4  80.39,81.03 180 top
U5  87.25,32.77 270 top
U6  67.06,33.02 90 top
U7  77.98,23.24 180 top
U8  77.47,43.31 0 top

### Tracks (layer width: path | path; a pad name or v marks a point on that pad's centre or on a via)
3V3_ANLG  (via drill 0.35)
  Top 0.406: v18.03,31.62 19.94,31.62 20.41,32.09 R30.2 21.76,33.27 22.77,34.28 24.68,34.28 25.11,33.85 R28.2 | Q14.3 24,30.99 25.11,32.09 R28.2 | v27.94,32 28.19,31.75 31.09,31.75 31.75,31.09 Q13.3 31.75,29.01 32.31,28.45 v32.44,28.45 | v26.16,32.51 26.16,32.77 25.65,33.27 R28.2 | R26.2 36.92,30.06 v35.31,28.45 | JP5.3 13.72,30.99 v13.97,30.73 | v16,30.91 Q15.3
  Bottom 0.406: v27.94,32 26.67,32 v26.16,32.51 | v35.31,28.45 v32.44,28.45 | v13.97,30.73 14.35,30.35 15.37,30.35 15.81,30.8 | 15.81,30.8 16.64,31.62 v18.03,31.62 | 15.81,30.8 15.88,30.8 v16,30.91
3V3_FET
  Top 0.406: JP5.1 8.51,25.27 8.51,16.89 10.76,14.64 R22.2 13.8,14.64 14.04,14.41 Q9.2 15.1,14.39 R20.2 23.95,14.39 Q7.2 24.05,14.48 24.05,14.81 25.51,16.28 26.76,16.28 28.13,14.9 R7.2 29.45,14.66 Q3.2
3V3_LOW  (via drill 0.35)
  Top 0.254: v81.03,33.27 80.64,32.89 IC3.14
  Top 0.406: C4.2 81.92,31.5 81.03,32.38 v81.03,33.27 | JP2.1 28.7,7.11 16.76,7.11 5.46,18.41 5.46,26.3 7.61,28.45 JP5.2 | JP9.2 JP9.4 JP9.6 34.65,55.6 44.33,55.6 45.96,53.98 51.31,53.98 62.56,42.73 68.53,42.73 v75.56,35.69
  Bottom 0.406: v75.56,35.69 79.88,35.69 81.03,34.54 v81.03,33.27 | JP5.2 9.04,29.62 9.42,29.62 11.81,32 11.81,33.53 25.02,46.74 25.02,51.69 26.8,53.47 JP9.2
3V3_LOW1
  Top 0.406: Q13.6 Q13.5
3V3_LOW2
  Top 0.406: Q14.6 Q14.5
3V3_LOW3
  Top 0.406: Q15.5 Q15.6
3V3_LOW_1
  Top 0.406: JP2.3 31.75,7.38 32.99,8.63 32.99,10.77 34.58,12.35 Q3.3
3V3_LOW_2  (via drill 0.35)
  Top 0.406: JP2.5 33.51,6.6 32.27,5.36 28.69,5.36 28.34,5.71 v26.67,5.71 | v26.29,12.7 26.29,15.15 Q7.3
  Bottom 0.406: v26.67,5.71 26.16,6.22 26.16,12.57 v26.29,12.7
3V3_LOW_3  (via drill 0.35)
  Top 0.406: Q9.3 18.41,15.37 v18.67,15.11 | v30.35,7.75 29.83,7.75 29.73,7.85 25.81,7.85 v25.15,8.51
  Bottom 0.406: v18.67,15.11 25.15,8.64 v25.15,8.51 | v30.35,7.75 31.13,7.75 31.23,7.85 35.59,7.85 JP2.7
5V_OUT1
  Top 0.406: JP2.11 42.16,6.6 43.56,5.21 46.61,5.21 49.66,8.26 49.66,13.5 Q5.3 50.67,16.73 50.67,22.43 50.93,22.69 Q17.5 Q17.6
5V_OUT2  (via drill 0.35)
  Top 0.406: JP2.13 44.45,7.38 43.2,8.63 43.2,9.66 43.31,9.76 43.31,13.88 44.29,14.86 Q11.3 44.16,15.49 44.16,15.75 43.05,16.86 v43.05,16.89 | Q18.6 Q18.5 43.69,23.88 43.43,23.62 v43.43,23.24
  Bottom 0.406: v43.05,16.89 43.05,22.86 v43.43,23.24
6V_IN  (via drill 0.35)
  Top 0.254: C3.1 34.86,65.98 35.32,66.44 35.32,67.31 | v37.46,71.25 36.92,71.25 IC1.13 | IC1.5 35.32,67.31 | v36.07,67.31 35.32,67.31
  Top 0.406: D1.C 31.32,64.47 31.5,64.64 31.5,66.38 D2.C 32.64,66.55 33.21,65.98 34.86,65.98
  Bottom 0.254: 37.6,71.17 38.05,71.17 38.35,70.87 38.35,68.45 37.2,67.3 36.08,67.3 v36.07,67.31
  Bottom 0.406: 37.6,71.17 37.53,71.25 v37.46,71.25
3113_ANLG  (via drill 0.35)
  Top 0.406: v44.83,31.75 44.83,30.52 Q18.3 44.96,28.45 v44.83,28.32 | v51.94,31.75 52.2,31.5 Q17.3 | v50.55,32.64 50.29,32.89 50.29,34 R34.2 R36.2 48.13,33.95 v48.13,32.13
  Bottom 0.406: v48.13,32.13 47.75,31.75 v44.83,31.75 | v44.83,28.32 41.53,25.02 JP10.3 | v50.55,32.64 51.05,32.64 v51.94,31.75
3113_FET  (via drill 0.35)
  Top 0.406: R8.2 53.9,16.6 | 53.9,16.6 Q5.2 | v50.16,16.13 50.13,16.09 R24.2 48.26,16.34 46.41,16.34 Q11.2 46.39,16.71 45.57,17.53 43.69,17.53 41.15,20.07 38.35,20.07 36.45,21.97 JP10.1 | v52.2,16.51 52.28,16.6 53.9,16.6
  Bottom 0.406: v50.16,16.13 50.93,16.13 51.31,16.51 v52.2,16.51
3113_IN  (via drill 0.35)
  Top 0.152: IC2.6 77.22,67.31
  Top 0.254: IC2.4 | IC2.5
  Top 0.406: 77.22,67.31 IC2.5 | IC2.4 IC2.5 | IC2.14 76.5,62.28 76.24,62.54 74.79,62.54 v74.47,62.87 73.91,63.42 73.91,65.98 72.58,67.31 69.57,67.31 C13.2 69.47,69.85 65.66,73.66 63.88,73.66 62.48,75.06 JP12.9 | IC2.6 77.14,68.32 v76.63,68.83 77.09,69.29 77.09,69.76 77.6,70.27 C16.1 | Q1.3 58.89,19.08 57.91,20.07 57.91,24.85 Q16.5 Q16.6 59.31,24.13 59.82,23.62 62.66,23.62 62.91,23.88 64.32,23.88 v64.58,24.13 | v65.02,46.74 66.17,47.88 66.42,47.88 67.56,49.02 67.56,52.2 67.31,52.45 67.31,54.1 | R12.1 74.68,69.76 74.68,69.47 v75.18,68.96 | v69.98,56.77 67.31,54.1 | 67.31,54.1 66.93,54.48 66.93,55.5 66.55,55.88 64.01,55.88 61.92,57.97 61.92,58.15 61.58,58.49 61.52,58.49 v60.96,59.05
  Bottom 0.406: v64.58,24.13 65.1,24.65 65.1,28.43 64.19,29.34 64.19,45.9 v65.02,46.74 | v76.63,68.83 76.51,68.96 v75.18,68.96 75.18,66.55 74.47,65.83 v74.47,62.87 73.91,62.87 72.9,61.85 72.9,60.71 69.98,57.78 v69.98,56.77 | v60.96,59.05 60.07,59.05 59.44,59.69 57.53,59.69 JP7.4
3113_OUT  (via drill 0.35)
  Top 0.406: JP9.12 JP9.10 | JP9.12 40.13,52.69 38.89,51.44 38.89,45.37 38.38,44.86 38.38,37.74 39.95,36.17 39.95,23.31 JP10.2 | JP9.12 44.96,48.64 v54.1,48.64 | C12.2 85.04,69.27 83.24,69.27 v82.93,68.96 | v81.53,68.07 81.15,68.45 79.88,68.45 79.75,68.31 IC2.2 IC2.3 79.09,68.05 79.12,68.07 78.49,68.71 78.49,69.85 79.16,70.52 C15.1 79.67,70.36 80.14,70.36 80.52,70.74 80.52,71.37 81.11,71.97 C10.1
  Bottom 0.406: JP10.2 38.99,10.9 38.08,9.99 38.08,7.9 JP2.9 | v54.1,48.64 54.36,48.39 64.9,48.39 66.29,49.78 | v82.93,68.96 82.42,68.96 v81.53,68.07 81.66,67.94 81.66,56.38 82.04,55.99 82.04,54.1 81.35,53.41 75.64,53.41 73.79,51.56 72.14,51.56 71.63,51.05 71.63,49.66 70.23,48.26 67.82,48.26 66.29,49.78 | 66.29,49.78 JP3.2
3130_IN  (via drill 0.35)
  Top 0.254: IC3.2 IC3.3 IC3.4 75.31,32.39 74.68,31.75 74.68,29.97 75.31,29.34 75.31,28.03 C9.1 | 75.06,27.9 75.02,27.94
  Top 0.406: v76.45,28.7 76.45,28.57 76.07,28.19 75.73,28.19 C9.1 75.06,27.9 | v82.05,28.83 C8.2 | 75.02,27.94 71.88,27.94 71.5,28.32 C19.2 69.5,30.33 69.09,30.73 69.09,35.31 62.23,42.16 v62.1,42.16 | JP7.6 60.2,59.56 v60.2,46.35
  Bottom 0.254: v76.45,28.7 76.58,28.83
  Bottom 0.406: JP7.6 60.83,62.99 60.83,67.76 60.51,68.08 60.51,72.63 60.58,72.7 60.58,74.3 JP12.7 | v62.1,42.16 60.2,44.07 v60.2,46.35 | v82.05,28.83 v82.04,28.83 76.58,28.83
BQ_ANLG
  Top 0.406: Q16.3 59.18,30.52 59.18,31.75 59.66,32.23 63.35,32.23 63.97,32.85 R32.2 63.97,34.54 58,40.51 54.36,40.51 52.32,42.55 JP6.3
BQ_FET  (via drill 0.35)
  Top 0.406: R6.2 61.01,16.6 Q1.2 60.99,17.09 62.48,18.58 v62.48,19.68
  Bottom 0.406: v62.48,19.68 62.48,23.75 63.5,24.77 63.5,32.26 63.12,32.64 63.12,37.21 JP6.1
BQ_OUT1  (via drill 0.35)
  Top 0.254: F1.2 49.66,78.36 49.91,78.11 49.91,77.34 JP12.1
  Top 0.406: 49.66,69.34 v49.78,69.47 | 49.66,69.34 46.74,69.34 46.48,69.09 46.48,68.49 R5.2 45.72,68.33 45.47,68.07 45.47,67.66 45.25,67.45 44.71,67.45 44.32,67.06 44.32,66.67 43.31,65.66 43.31,63.72 R39.2 | JP7.3 JP7.1 52.32,58.42 51.82,58.93 51.82,61.47 50.93,62.36 50.93,66.67 49.66,67.94 49.66,69.34
  Bottom 0.406: v49.78,69.47 50.04,69.72 50.04,72.01 52.2,74.17 JP12.1
BQ_OUT1_1  (via drill 0.35)
  Top 0.254: v39.5,69.61 v39.49,69.6 IC1.10 | F1.1 45.49,77.85 v44.58,77.85
  Top 0.406: v39.62,67.44 39.49,67.44 38.99,66.93 38.99,66.3 38.61,65.92 C17.1 39.49,65.92 39.75,65.66 39.75,65.28 40.01,65.02 40.26,65.02 40.77,64.52 40.77,63.75 41.02,63.5 R39.1
  Bottom 0.254: v39.62,67.44 39.62,69.48 v39.5,69.61 39.5,70.1 39.24,70.36 39.24,71.12 39.62,71.5 39.62,72.64 41.15,74.17 42.67,74.17 44.07,75.56 44.07,77.6 44.32,77.85 v44.58,77.85
BQ_OUT2  (via drill 0.35)
  Top 0.254: R4.2 47.5,70.91 47.5,73.79 48.39,74.68 F2.2
  Top 0.406: v48.77,69.98 48.77,70.06 48.48,70.36 47.46,70.36 R4.2 47.46,70.87 52.32,70.87 54.74,73.28 JP12.3 | v54.23,63.37 54.99,62.61 54.99,60.2 55.52,59.66 56.78,59.66 58.02,58.42 JP7.5 57.4,57.02 52.45,57.02 48.35,61.13 R38.2
  Bottom 0.406: v48.77,69.98 48.77,68.13 53.53,63.37 v54.23,63.37
BQ_OUT2_2  (via drill 0.35)
  Top 0.254: F2.1 44.59,74.17 43.31,74.17 42.93,73.79 42.93,73.53 C18.1 40,72.77 39.5,72.26 39.5,71.33 38.26,70.1 IC1.11
  Top 0.406: C18.1 43.69,72.77 44.32,72.14 v44.32,71.37 | R38.1 45.97,64.77 v45.09,65.66
  Bottom 0.406: v44.32,71.37 43.56,70.61 43.56,66.93 44.12,66.37 44.18,66.37 44.89,65.66 v45.09,65.66
BQ_OUT3  (via drill 0.35)
  Top 0.406: v44.7,51.31 43.43,52.58 v43.43,53.09 41.66,54.86 36.45,54.86 JP9.8 | JP12.5 57.28,73.79 55.63,72.14 55.63,68.77 55.55,68.69 55.55,66.6 54.23,65.28 54.23,64.39 53.21,63.37 53.21,61.47 JP7.2
  Bottom 0.406: JP6.2 54.86,46.36 49.92,51.31 v44.7,51.31 | JP7.2 51.31,60.96 v43.43,53.09
BURST
  Top 0.406: IC2.8 75.84,69.32 75.56,69.6 75.56,75.56 JP4.2
GND  (via drill 0.35)
  Top 0.254: IC3.19 77.09,32.89 IC3.21 | IC3.12 78.09,31.89 IC3.21 | IC2.21 76.5,64.39 IC2.7 | IC3.8 77.09,31.11 77.09,32.38 IC3.21 | IC2.21 78.36,63.5 80.14,63.5 80.39,63.24 IC2.20 | IC2.1 80.39,65.66 80.14,65.41 78.49,65.41 IC2.21 | IC1.6 35.82,68.86 35.94,68.98 35.94,69.22 36.07,69.34 IC1.17 | IC1.17 36.07,69.72 36.82,68.97 IC1.8 | IC1.17 v35.56,70.36 | IC1.17 36.07,70.34 36.32,70.59 IC1.14
  other vias: 81.92,27.3 11.3,56.52 5.33,62.87 73.66,61.72 23.62,69.72 14.99,41.78 24.13,47.75 23.5,55.63 73.15,67.56 74.8,74.3 18.54,74.42 81.03,36.96 79.12,34.92 80.14,31.88 65.28,56.52 75.56,37.72 65.02,37.85 79.25,30.35 75.18,30.61 69.85,34.8 73.66,39.12 65.41,8.26 68.45,6.22 64.64,10.29 65.53,4.19 62.1,4.19 86.23,21.34 88.9,17.4 87.88,30.23 92.2,70.1 81.03,65.15 91.69,57.53 72.14,60.83 72.9,62.87 33.91,72.39 32.38,78.36 43.18,78.11 35.31,78.23 37.59,78.36 40.26,78.23 81.15,74.93 88.01,61.98 69.22,40.13 60.96,38.48 66.42,44.96 16.26,43.31 76.2,46.61 71.5,41.66 64.39,27.94 65.02,32.89 62.87,31.5 28.45,57.91 64.26,25.53 82.04,42.16 68.58,16.38 74.03,21.46 81.53,21.34 94.36,71.75 73.28,70.87 68.71,72.77 63.37,70.23 69.22,71.25 67.31,75.44 65.53,17.27 84.07,42.04 83.44,39.75 82.04,35.69 85.09,34.92 71.37,37.59 85.34,39.12 59.05,40.39 22.99,42.29 26.8,71.5 24.77,74.42 21.46,68.33 66.42,28.83 73.15,16.38 16.51,40.26 6.22,50.29 21.97,59.69 20.32,57.4 19.05,52.96 15.24,62.1 21.59,71.63 15.24,52.2 23.24,52.96 5.33,65.28 9.65,62.87 14.99,74.42 3.43,71.25 6.48,72.01 17.53,68.45 3.81,59.82 6.22,78.11 4.19,77.09 14.35,72.14 5.21,74.17 23.11,76.33 2.03,75.31 15.37,78.49 16.76,76.71 14.48,69.85 19.68,63.25 58.42,8.13 77.72,16.38 86.49,28.83 81.03,29.72 74.55,34.29 70.61,23.75 86.74,37.34 66.17,24.89 65.53,15.24 85.72,12.83 73.15,12.7 77.85,12.7 77.6,6.6 81.66,6.6 85.09,9.65 85.72,16.13 86.61,25.4 81.79,25.53 72.77,46.61 72.77,50.16 74.68,53.72 70.36,54.61 62.23,58.8 66.17,54.99 53.34,64.77 23.37,60.71 38.99,59.94 33.15,61.59 40.39,65.91 41.02,61.47 91.69,61.98 87.12,74.93 92.2,71.88 94.61,74.93 92.2,74.93 50.93,70.1 33.02,59.94 10.79,68.71 2.79,78.99 47.88,75.06 44.32,79.76 65.28,78.61 65.28,76.45 69.47,78.36 65.15,74.42 53.72,66.8 51.05,72.01 53.21,73.28 53.59,71.25 47.5,76.83 56.39,71.88 53.72,69.09 44.83,62.23 47.88,66.93 36.2,57.78 85.09,6.6 84.33,65.28 84.45,62.1 83.31,67.31 24.77,71.5 32.64,73.41 94.61,77.98 92.2,77.98 89.79,77.98 78.49,70.99 63.63,57.15 83.82,77.98 87.12,77.98 81.03,69.09 81.03,77.98 77.22,79.25 71.63,78.11 69.34,74.42 67.69,78.61 82.68,37.97 66.04,40.26 77.72,33.66 76.83,32.89 24.77,65.28 49.66,72.52 47.5,80.52 46.99,72.26 40.13,71.75 35.56,69.6 36.58,70.1 76.33,63.5 76.33,64.39 76.33,65.28 77.22,65.28 77.22,64.39 77.22,63.5 78.23,63.5 78.23,64.39 78.23,65.28 73.41,32.26 38.1,67.44 40.13,74.04 65.53,12.7 68.45,9.78 79.88,20.7 65.15,72.01 13.59,50.29 45.47,64.01 64.9,35.56 42.8,66.04 25.78,68.33 49.53,61.72 88.65,20.19 81.53,23.62 73.15,6.6 73.15,9.65 77.6,9.78 81.66,12.57 81.53,9.78 19.05,42.42 21.59,49.4 18.03,59.44 23.37,57.66 26.16,76.33 8.64,59.56 12.7,53.72 7.62,17.4 39.24,57.78 18.92,43.81 84.07,46.1 66.67,71.12 50.93,67.69 62.87,39.5 60.58,41.66 56.77,19.94 54.74,21.84 49.53,25.15 47.5,23.37 41.15,27.3 37.59,28.07 37.47,26.04 33.78,25.91 30.86,26.16 13.21,29.72 21.46,24.64 20.95,29.08 10.79,18.03 13.46,17.53 9.65,20.32 11.81,13.46 14.86,11.3 16.64,9.53 19.56,11.43 18.54,13.34 18.92,8.13 21.21,9.27 22.86,12.83 23.88,8 24.77,11.18 21.34,17.91 18.29,17.78 18.41,21.46 29.34,22.99 27.18,19.68 25.78,17.53 27.56,16.38 27.43,13.72 27.43,11.68 29.59,11.68 31.24,13.21 32,11.56 35.94,16.13 31.11,15.75 30.35,20.95 22.73,15.11 26.16,21.59 32.13,23.11 34.54,22.1 35.56,18.92 34.92,17.78 35.56,13.46 35.69,11.56 37.59,13.08 37.97,14.86 37.72,16.76 40.26,19.05 40.89,16.51 40.89,14.73 40.89,12.83 45.72,11.43 47.24,12.95 51.69,19.43 49.91,21.08 49.91,18.8 47.37,18.92 47.24,7.49 51.82,4.19 55.24,4.19 54.23,8.26 54.1,12.19 57.91,11.94 61.85,8.26 61.85,11.94 68.45,12.57 65.15,20.19 4.95,17.14 8.64,12.83 11.05,10.67 13.59,8.64 15.88,6.48 18.92,5.84 22.61,5.59 25.53,5.33 27.56,4.32 28.83,24.38 28.45,27.3 28.7,30.61 25.91,31.75 24.13,32.13 22.1,32.26 20.83,30.73 18.8,30.99 12.95,31.75 13.84,34.42 10.54,33.27 8.13,32.89 10.67,37.72 11.05,39.37 11.94,41.66 9.78,43.94 13.97,43.81 13.97,46.48 18.16,47.62 25.53,55.63 24.64,62.61 25.78,57.91 31.11,57.78 35.81,59.94 33.78,57.78 78.49,48.39 42.8,48.01 42.8,45.97 42.93,43.56 42.67,40.51 40.77,37.85 38.99,39.62 34.04,39.75 35.05,36.96 31.75,38.23 29.97,39.62 36.45,39.12 30.48,36.32 30.23,34.16 27.94,37.08 28.07,38.61 25.02,39.5 22.61,37.85 19.3,36.45 18.92,38.99 16,36.58 15.11,38.99 21.21,40.89 22.23,44.83 25.91,47.88 28.07,48.01 30.48,47.88 33.15,47.88 35.69,47.75 38.23,46.35 38.23,48.39 41.78,48.77 39.75,47.62 47.12,49.78 44.07,50.93 50.04,49.28 52.07,50.67 50.8,52.7 47.24,52.83 40.01,64.39 50.8,54.99 52.58,53.85 55.24,53.34 62.1,61.59 62.87,45.85 62.23,56.52 60.83,49.28 63.12,55.24 50.16,64.26 56.26,66.55 47.88,68.2 94.61,67.82 79.76,54.48 84.58,54.23 71.37,48.13 82.42,47.75 86.87,50.29 69.34,46.61 62.99,44.32 51.94,47.12 48.9,47.12 46.1,47.12 46.61,45.09 49.28,44.83 46.86,42.55 49.53,43.18 47.12,40.77 44.45,42.04 44.32,38.86 46.48,38.86 49.02,38.86 50.04,41.02 52.07,39.12 56.39,39.62 57.78,38.1 59.56,37.59 60.83,35.69 59.31,43.94 56.64,36.45 55.37,35.18 49.28,35.94 45.34,35.94 40.77,34.8 40.89,33.66 38.61,34.54 38.61,33.02 35.94,31.88 35.81,30.48 32.38,31.11 30.1,32.38 21.46,27.18 21.34,22.61 13.21,27.56 7.24,22.73 7.11,19.94 4.57,20.57 4.57,23.37 4.57,26.16 4.95,30.99 5.33,32.89 5.46,34.54 8.38,41.4 9.91,46.48 6.35,55.37 5.46,46.48 5.33,41.4 5.46,43.94 5.33,67.69 12.32,59.44 15.49,56.77 38.35,30.23 41.4,31.11 41.4,29.08 49.28,30.48 52.58,32.38 54.86,32.13 57.02,32.51 56.26,30.73 61.34,28.32 56.52,25.53 56.64,18.29 58.55,20.57 61.09,18.16 63.75,18.8 84.07,24.26 74.04,23.62 66.17,22.1 81.66,16.26 66.42,26.54 76.07,20.83 58.67,4.19 48.77,5.33 46.86,26.42 47.24,15.24 50.42,15.24 40.77,11.18 42.29,19.94 40.26,20.7 45.34,23.5 48.77,27.94 47.12,32.51 45.47,33.02 49.28,34.67 49.28,32.51 68.45,43.43 87.25,42.55 88.14,59.44 91.95,67.82 91.06,65.91 84.45,59.44 84.33,57.66 79.12,52.7 70.74,73.03 67.56,70.23 64.9,30.48 6.86,14.86 13.72,66.17 7.24,69.47 11.43,74.3 18.67,78.49 21.46,78.49 21.46,74.42 24.64,78.49 40.13,75.69 50.04,80.26 44.45,69.72 39.88,70.61 41.66,69.09 81.03,62.99 80.52,72.26 89.92,74.93 83.82,74.93 88.14,57.66 91.69,59.44 83.44,71.5 85.6,52.7 79.88,55.37 82.17,52.7 76.71,52.7 72.77,54.61 80.39,46.74 72.77,52.45 70.99,53.85 73.53,43.31 87.38,40.39 71.37,33.53 63.37,42.04 50.42,8.51 48.39,10.29 51.69,13.21 13.84,22.61 10.67,22.73 13.08,25.78 11.05,28.19 70.1,27.56 40.01,62.61 62.48,36.96 44.7,57.78 41.15,59.94 41.4,57.91 43.05,54.86 42.16,52.83 29.08,17.65 58.55,14.35 82.55,44.83 85.22,48.01 56.26,70.36 56.13,68.45 58.93,68.45 58.93,70.36 58.93,72.14 61.09,72.39 61.21,70.23 61.34,68.33 58.93,66.55 59.56,62.87 61.59,65.53 55.88,51.31 57.91,50.42 57.78,53.47 57.91,55.63 54.99,55.63 50.8,57.15 47.24,54.99 51.05,59.69 58.8,47.37 57.4,46.48 61.72,47.5 64.77,47.75 55.5,47.5 52.96,36.2 53.85,62.61 59.94,31.62 56.39,28.32 45.59,29.21 61.34,57.91 60.96,52.96 61.72,54.99 80.26,34.04 35.56,72.64 36.83,72.64 38.99,71.75 37.97,71.88 11.05,30.23 21.46,34.04 17.65,33.4 25.15,41.27 77.6,31.62 77.85,32.89 23.62,67.82 34.16,67.82 51.82,62.61 64.52,55.12 61.59,60.33 56.26,64.52 20.32,17.91 38.99,68.58 32.89,64.52 30.48,64.39 27.43,64.52 77.09,56.01 76.2,71.12 77.6,68.83 85.47,73.03 94.61,69.98 91.69,55.12 91.69,52.7 88.52,52.7 47.24,59.94 32.77,70.36 61.21,21.84 76.58,51.56 78.74,51.56 81.15,51.56 83.19,51.56 97.03,59.82 97.03,61.34 97.03,64.77 97.03,66.8 83.82,81.03 82.3,81.03 78.87,81.03 76.71,81.03 64.01,67.06 64.01,65.53 64.01,61.59 64.01,59.94 77.98,23.24 67.06,33.02 77.47,43.31 87.25,32.77 77.6,60.2 73.53,28.57 44.32,29.08 16.13,15.11 13.97,15.37 14.73,13.21
  pour Top: -0.76,83.59 103.89,83.59 103.89,-1.02 -0.76,-1.02
  pour Bottom: -0.64,83.82 102.87,83.82 102.87,-0.86 -0.64,-0.86
IO_1  (via drill 0.35)
  Top 0.406: v17.65,34.42 17.27,34.42 16.6,33.74 R31.2 | JP9.1 26.92,50.42 JP8.1 28.07,42.29 28.07,40.13 29.21,38.99 29.21,33.44 R29.2 | R27.2 33.02,33.23 Q13.2 33.15,29.64 33.15,27.81 35.05,25.91 35.05,23.27 34.78,22.99 32.92,22.99 31.97,22.04 Q4.1 28.59,21.66 R14.2 | R29.2 R27.1 R27.2 | R27.2 33.11,33.4 33.11,33.91 35.27,36.07 v38.1,36.07 | v44.83,35.31 44.54,35.01 R37.2 45,34.04 46.27,35.3 54.27,35.3 55.53,34.04 R35.2 R33.2 | R29.2 28.79,33.53 28.79,33.95 28.45,34.29 v28.19,34.29
  Bottom 0.406: v17.65,34.42 17.78,34.42 18.03,34.67 26.8,34.67 27.18,34.29 v28.19,34.29 | v44.83,35.31 44.07,36.07 v38.1,36.07
IO_2  (via drill 0.35)
  Top 0.406: R21.2 21.45,21.66 Q8.1 23.71,22.19 24.26,22.73 27.43,22.73 27.81,23.11 27.81,26.28 25.27,28.82 Q14.2 25.27,30.73 25.65,31.11 26.16,31.11 26.92,31.88 26.92,32.13 27.34,32.55 R29.1 27.09,33.53 26.67,33.53 26.42,33.78 26.42,40.71 v26.67,40.97 | JP8.2 29.46,50.42 JP9.3
  Bottom 0.406: v26.67,40.97 26.85,41.15 28.07,41.15 29.46,42.55 JP8.2
IO_3  (via drill 0.35)
  Top 0.406: R23.2 12.68,21.79 Q10.1 15.08,22.32 15.37,22.61 19.3,22.61 19.68,22.99 19.68,26.16 17.27,28.57 Q15.2 17.27,31.15 16.93,31.5 15.88,31.5 14.9,32.47 R31.1 14.9,33.82 15.17,34.09 v15.62,34.09 | JP8.3 32,50.42 JP9.5
  Bottom 0.406: v15.62,34.09 21.92,40.39 29.84,40.39 32,42.55 JP8.3
IO_4  (via drill 0.35)
  Top 0.406: R15.2 62.52,21.25 62.03,20.76 Q2.1 60.99,21.18 v60.33,21.84 | JP9.7 34.54,50.42 JP8.4 34.54,42.16 35.81,40.89 v37.72,40.89 | 59.31,34.04 R33.1 59.18,33.95 59.18,33.4 57.23,31.45 57.23,29.63 58.55,28.31 v58.55,26.54 | 59.31,34.04 60.07,34.04 v60.58,33.53 | v61.09,31.65 60.96,31.65 60.58,31.27 Q16.2 | 59.31,34.04 59.31,36.2 58.29,37.21 42.55,37.21 v40.64,39.12
  Bottom 0.406: v60.58,33.53 61.09,33.02 v61.09,31.65 | v58.55,26.54 58.55,23.62 v60.33,21.84 | v40.64,39.12 38.86,40.89 v37.72,40.89
IO_5  (via drill 0.35)
  Top 0.406: Q6.1 56.02,20.88 R13.2 56.13,21.5 55.68,21.5 55.51,21.68 55.51,23.84 55.75,24.08 55.75,27.17 53.47,29.45 Q17.2 53.47,32.26 54.01,32.8 R35.1 53.21,34.04 v53.09,34.16 | JP9.9 37.08,50.42 JP8.5
  Bottom 0.406: v53.09,34.16 50.55,36.7 40.89,36.7 36.96,40.64 36.96,43.31 JP8.5
IO_6
  Top 0.406: JP9.11 40.89,50.16 40.89,44.7 JP8.6 39.62,37.25 R37.1 44.49,32.38 45.21,32.38 46.23,31.37 Q18.2 46.23,28.07 48.77,25.53 R25.2 47.71,22.06 46.39,20.73 Q12.1
N$1
  Top 0.254: IC1.15 35.82,72.05 36.2,72.43 36.2,73.32 R1.1
N$2
  Top 0.254: R2.1 38.48,73.32 38.48,71.13 37.95,70.6 IC1.12
N$3
  Top 0.254: IC1.9 39.9,69.1 40.4,69.6 40.4,70.74 40.52,70.87 LED2.C
N$4
  Top 0.254: IC1.1 34.05,70.6 33.15,71.5 33.15,75.95 32.77,76.33 31.5,76.33 R3.2
N$5
  Top 0.254: LED1.C 40.91,68.07 37.59,68.07 37.21,67.69 36.45,67.69 36.32,67.82 IC1.7
N$6
  Top 0.406: R5.1 44.49,68.2 LED1.A
N$7
  Top 0.406: LED2.A 43.18,70.87 43.43,70.61 R4.1
N$8
  Top 0.406: R7.1 32.46,16.6 | 32.46,16.6 Q3.1 | Q4.3 34.07,18.7 32.46,17.09 32.46,16.6
N$9
  Top 0.406: J2.1 13.21,41.27 16.64,44.7 19.56,44.7 24.26,49.4 24.26,61.09 25.53,62.36 D1.A
N$10
  Top 0.406: Q2.3 58.89,21.34 59.94,20.29 59.94,16.13 60.99,15.08 Q1.1 63.39,14.66 R6.1
N$11  (via drill 0.35)
  Top 0.406: R8.1 56.15,14.66 Q5.1 53.88,15.15 54.23,15.49 v54.86,15.49 | v54.1,18.41 51.78,20.73 Q6.3
  Bottom 0.406: v54.86,15.49 54.86,17.65 v54.1,18.41
N$12
  Top 0.406: IC2.18 IC2.19 79.84,61.37 79.84,60.6 80.12,60.33 80.9,60.33 81.15,60.58 81.15,61.34 84.26,64.44 L2.1
N$13  (via drill 0.35)
  Top 0.406: IC2.15 IC2.16 IC2.17 78.44,60.49 v78.61,60.33 | v81.21,55.5 88.21,55.5 L2.2
  Bottom 0.406: v81.21,55.5 81,55.7 81,59.72 80.39,60.33 v78.61,60.33
N$14
  Top 0.406: R18.2 73.15,56.77 73.61,56.31 73.61,53.86 72.96,53.21 70.61,53.21 68.83,51.44 JP3.3
N$15
  Top 0.254: IC3.20 76.59,34.8 | 76.59,34.8 76.59,39.13 L1.1 | C6.2 74.59,35.14 74.93,34.8 76.59,34.8
N$16
  Top 0.254: IC3.1 75.16,33.89 74.72,33.44 C6.1
N$17
  Top 0.254: C7.2 82.26,36.79 79.36,33.89 IC3.16
N$18
  Top 0.406: IC2.9 75.18,67.33 75.18,68.09 74.82,68.45 74.42,68.45 73.91,68.96 72.39,68.96 72.14,69.22 R11.2
N$19
  Top 0.152: IC3.15 78.86,33.4
  Top 0.254: 78.86,33.4 80.39,33.4 82.08,35.09 C7.1
  Top 0.406: L1.2 81.54,39.5 82.3,38.73 83.57,38.73 84.71,37.59 84.71,35.47 84.33,35.09 C7.1
N$20
  Top 0.406: R12.2 74.42,72.9 73.53,73.79 JP4.3
N$21
  Top 0.406: C11.1 77.94,54.99 77.94,57.23 R17.1
N$22  (via drill 0.35)
  Top 0.406: R16.1 81.7,57.44 82.17,57.91 v82.24,57.91 | v82.3,67.94 82.3,68.45 82.17,68.58 C10.2
  Bottom 0.406: v82.3,67.94 82.24,67.89 v82.24,57.91
N$23  (via drill 0.35)
  Top 0.406: R10.2 R9.1 71.63,58.04 71.88,58.29 71.88,58.67 72.35,59.14 R18.1 73.15,60.2 73.53,60.58 v73.79,60.58 | v75.78,60.2 75.78,60.54 75.84,60.6 IC2.13 | C11.2 75.6,54.86 75.44,55.03 C14.2 76.11,57.44 76.58,57.91 v76.58,58.42 76.71,58.29 78.49,58.29 79.34,59.14 R16.2
  Bottom 0.406: v73.79,60.58 74.04,60.58 74.42,60.2 v75.78,60.2 75.95,60.2 76.58,59.56 v76.58,58.42
N$24
  Top 0.406: IC2.12 75.19,59.39 C14.1 R17.2
N$25
  Top 0.254: IC1.16 35.32,71.98 34.42,72.89 R19.1
N$26  (via drill 0.35)
  Top 0.406: v68.2,56.64 68.2,57.66 68.58,58.04 R9.2
  Bottom 0.406: JP3.1 63.75,53.21 65.28,54.74 65.28,55.24 66.17,56.13 67.69,56.13 v68.2,56.64
N$27
  Top 0.406: Q8.3 25.78,20.67 25.78,18.52 23.97,16.71 Q7.1 23.95,16.34 21.46,16.34 R20.1
N$28
  Top 0.406: R22.1 12.46,16.33 Q9.1 15.08,16.86 17.18,18.96 Q10.3
N$29  (via drill 0.35)
  Top 0.406: R24.1 48.5,14.41 Q11.1 45.52,14.41 45.09,13.97 v44.32,13.97 | Q12.3 44.29,18.7 v44.45,18.54
  Bottom 0.406: v44.32,13.97 43.94,13.97 43.31,14.61 43.31,16 44.45,17.14 v44.45,18.54
N$30
  Top 0.406: R28.1 23.41,32.04 22.73,31.37 Q14.4 22.73,27.7 25.19,25.24 25.19,24.42 Q14.7 Q14.8
N$31  (via drill 0.35)
  Top 0.406: Q15.8 Q15.7 17.27,25.27 16.38,26.16 15.5,26.16 14.73,26.93 Q15.4 14.73,30.48 14.99,30.73 v14.99,30.99 | R30.1 18.71,32.55 18.54,32.38 v17.65,32.38
  Bottom 0.406: v17.65,32.38 17.42,32.16 15.77,32.16 14.99,31.37 v14.99,30.99
N$32
  Top 0.406: Q16.8 Q16.7 60.58,27.1 58.04,29.64 Q16.4 58.04,31.37 59.56,32.89 61.98,32.89 62.27,33.19 R32.1
N$33
  Top 0.406: Q17.8 Q17.7 53.47,26.42 53.21,26.67 52.08,26.67 50.93,27.82 Q17.4 50.93,32.17 52.03,33.27 R34.1
N$34  (via drill 0.35)
  Top 0.406: Q13.8 Q13.7 33.02,26.33 30.48,28.87 Q13.4 30.48,30.8 v30.72,31.04 | v34.04,31.62 34.16,31.62 35.22,32.68 R26.1
  Bottom 0.406: v30.72,31.04 31.43,31.75 33.91,31.75 v34.04,31.62
N$35  (via drill 0.35)
  Top 0.406: R36.1 46.52,32.68 v46.23,32.38 | v43.69,32 Q18.4 43.69,28.59 46.27,26 46.27,25.02 Q18.7 Q18.8
  Bottom 0.406: v46.23,32.38 44.07,32.38 v43.69,32
N$37
  Top 0.406: J3.1 J3.2 17.98,56.71 23.75,62.48 23.75,65.41 24.89,66.55 D2.A
V_BATT
  Top 0.254: IC1.3 IC1.2 33.91,70.1 32.77,71.25 32.77,72.01 32.38,72.39 31.5,72.39
  Top 0.406: JP1.1 9.78,78.49 J1.1 J1.2 20.95,71.12 21.72,70.36 28.06,70.36 C2.1 29.21,70.74 29.72,70.74 29.97,70.99 29.97,71.88 30.35,72.26 31.12,72.26 31.25,72.39 | 31.5,72.39 31.5,72.64 31.25,72.39 | 31.25,72.39 C1.1
VCC_3130
  Top 0.254: C5.2 78.09,28.72 78.09,29.72 | 78.09,29.72 IC3.10 | 78.09,29.72 76.2,29.72 75.84,30.07 IC3.6 IC3.5

### Text on the board
tPlace: NTC | GND | BAT_IN | GND | BURST | PWM | 3.3V/5V / 3A out / max | + | BQ_OUT1 | BQ_OUT2 | 3130_IN | 3113_IN | - | 3113_SW_IN | Charger | IO CTRL | + | EN_HI | 3V3/5V OUT | EN_LOW | LTC3113 | - | EN_HI_SW | IO_1 | IO_2 | IO_3 | IO_4 | IO_5 | IO_6 | 3.3V | 5V | SOLAR IN | 3113 / ANLG/FET | 6-10V / 950mA / max | 3130 / FET/ANALG | LTC3130-1 | 3113 / FET/ANLG | 3.3V | 3.3V / 600mA / out max | GND | GND | Ioannis Christou / Graeme Bragg / Kirk Martinez | 3V3_LO | 3V3_1 | 3V3_2 | 3V3_3 | HI_OUT | HI_1 | HI_2 | Glacialis / Meradalir / v2
bPlace: SW4_ANLG | SW6_ANLG | SW1_ANLG | SW3_ANLG | SW5_ANLG | SW2_ANLG | SW1_FET | SW2_FET | SW3_FET | SW4_FET | SW6_FET | SW5_FET